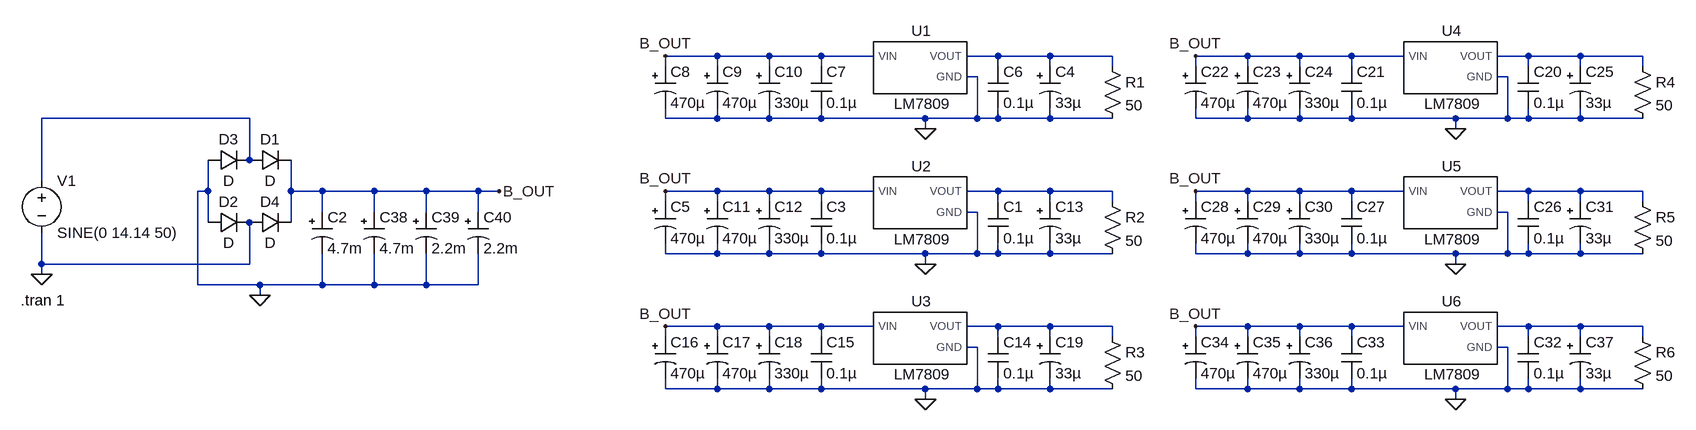
[diagram p0: schematic psu_230.asc]
psu_230.asc, the LTspice schematic file:
Version 4
SHEET 1 2616 680
WIRE 1136 112 1056 112
WIRE 1216 112 1136 112
WIRE 1296 112 1216 112
WIRE 1376 112 1296 112
WIRE 1568 112 1520 112
WIRE 1648 112 1568 112
WIRE 1744 112 1648 112
WIRE 1952 112 1872 112
WIRE 2032 112 1952 112
WIRE 2112 112 2032 112
WIRE 2192 112 2112 112
WIRE 2384 112 2336 112
WIRE 2464 112 2384 112
WIRE 2560 112 2464 112
WIRE 1056 128 1056 112
WIRE 1136 128 1136 112
WIRE 1216 128 1216 112
WIRE 1296 128 1296 112
WIRE 1568 128 1568 112
WIRE 1648 128 1648 112
WIRE 1744 128 1744 112
WIRE 1872 128 1872 112
WIRE 1952 128 1952 112
WIRE 2032 128 2032 112
WIRE 2112 128 2112 112
WIRE 2384 128 2384 112
WIRE 2464 128 2464 112
WIRE 2560 128 2560 112
WIRE 1536 144 1520 144
WIRE 2352 144 2336 144
WIRE 416 208 96 208
WIRE 1056 208 1056 192
WIRE 1136 208 1136 192
WIRE 1136 208 1056 208
WIRE 1216 208 1216 192
WIRE 1216 208 1136 208
WIRE 1296 208 1296 192
WIRE 1296 208 1216 208
WIRE 1456 208 1296 208
WIRE 1536 208 1536 144
WIRE 1536 208 1456 208
WIRE 1568 208 1568 192
WIRE 1568 208 1536 208
WIRE 1648 208 1648 192
WIRE 1648 208 1568 208
WIRE 1744 208 1648 208
WIRE 1872 208 1872 192
WIRE 1952 208 1952 192
WIRE 1952 208 1872 208
WIRE 2032 208 2032 192
WIRE 2032 208 1952 208
WIRE 2112 208 2112 192
WIRE 2112 208 2032 208
WIRE 2272 208 2112 208
WIRE 2352 208 2352 144
WIRE 2352 208 2272 208
WIRE 2384 208 2384 192
WIRE 2384 208 2352 208
WIRE 2464 208 2464 192
WIRE 2464 208 2384 208
WIRE 2560 208 2464 208
WIRE 1456 224 1456 208
WIRE 2272 224 2272 208
WIRE 416 272 416 208
WIRE 96 304 96 208
WIRE 352 320 352 272
WIRE 352 320 336 320
WIRE 480 320 480 272
WIRE 528 320 480 320
WIRE 608 320 528 320
WIRE 688 320 608 320
WIRE 768 320 688 320
WIRE 800 320 768 320
WIRE 1136 320 1056 320
WIRE 1216 320 1136 320
WIRE 1296 320 1216 320
WIRE 1376 320 1296 320
WIRE 1568 320 1520 320
WIRE 1648 320 1568 320
WIRE 1744 320 1648 320
WIRE 1952 320 1872 320
WIRE 2032 320 1952 320
WIRE 2112 320 2032 320
WIRE 2192 320 2112 320
WIRE 2384 320 2336 320
WIRE 2464 320 2384 320
WIRE 2560 320 2464 320
WIRE 1056 336 1056 320
WIRE 1136 336 1136 320
WIRE 1216 336 1216 320
WIRE 1296 336 1296 320
WIRE 1568 336 1568 320
WIRE 1648 336 1648 320
WIRE 1744 336 1744 320
WIRE 1872 336 1872 320
WIRE 1952 336 1952 320
WIRE 2032 336 2032 320
WIRE 2112 336 2112 320
WIRE 2384 336 2384 320
WIRE 2464 336 2464 320
WIRE 2560 336 2560 320
WIRE 528 352 528 320
WIRE 608 352 608 320
WIRE 688 352 688 320
WIRE 768 352 768 320
WIRE 1536 352 1520 352
WIRE 2352 352 2336 352
WIRE 352 368 352 320
WIRE 480 368 480 320
WIRE 1056 416 1056 400
WIRE 1136 416 1136 400
WIRE 1136 416 1056 416
WIRE 1216 416 1216 400
WIRE 1216 416 1136 416
WIRE 1296 416 1296 400
WIRE 1296 416 1216 416
WIRE 1456 416 1296 416
WIRE 1536 416 1536 352
WIRE 1536 416 1456 416
WIRE 1568 416 1568 400
WIRE 1568 416 1536 416
WIRE 1648 416 1648 400
WIRE 1648 416 1568 416
WIRE 1744 416 1648 416
WIRE 1872 416 1872 400
WIRE 1952 416 1952 400
WIRE 1952 416 1872 416
WIRE 2032 416 2032 400
WIRE 2032 416 1952 416
WIRE 2112 416 2112 400
WIRE 2112 416 2032 416
WIRE 2272 416 2112 416
WIRE 2352 416 2352 352
WIRE 2352 416 2272 416
WIRE 2384 416 2384 400
WIRE 2384 416 2352 416
WIRE 2464 416 2464 400
WIRE 2464 416 2384 416
WIRE 2560 416 2464 416
WIRE 96 432 96 384
WIRE 416 432 416 368
WIRE 416 432 96 432
WIRE 1456 432 1456 416
WIRE 2272 432 2272 416
WIRE 96 448 96 432
WIRE 336 464 336 320
WIRE 432 464 336 464
WIRE 528 464 528 416
WIRE 528 464 432 464
WIRE 608 464 608 416
WIRE 608 464 528 464
WIRE 688 464 688 416
WIRE 688 464 608 464
WIRE 768 464 768 416
WIRE 768 464 688 464
WIRE 432 480 432 464
WIRE 1136 528 1056 528
WIRE 1216 528 1136 528
WIRE 1296 528 1216 528
WIRE 1376 528 1296 528
WIRE 1568 528 1520 528
WIRE 1648 528 1568 528
WIRE 1744 528 1648 528
WIRE 1952 528 1872 528
WIRE 2032 528 1952 528
WIRE 2112 528 2032 528
WIRE 2192 528 2112 528
WIRE 2384 528 2336 528
WIRE 2464 528 2384 528
WIRE 2560 528 2464 528
WIRE 1056 544 1056 528
WIRE 1136 544 1136 528
WIRE 1216 544 1216 528
WIRE 1296 544 1296 528
WIRE 1568 544 1568 528
WIRE 1648 544 1648 528
WIRE 1744 544 1744 528
WIRE 1872 544 1872 528
WIRE 1952 544 1952 528
WIRE 2032 544 2032 528
WIRE 2112 544 2112 528
WIRE 2384 544 2384 528
WIRE 2464 544 2464 528
WIRE 2560 544 2560 528
WIRE 1536 560 1520 560
WIRE 2352 560 2336 560
WIRE 1056 624 1056 608
WIRE 1136 624 1136 608
WIRE 1136 624 1056 624
WIRE 1216 624 1216 608
WIRE 1216 624 1136 624
WIRE 1296 624 1296 608
WIRE 1296 624 1216 624
WIRE 1456 624 1296 624
WIRE 1536 624 1536 560
WIRE 1536 624 1456 624
WIRE 1568 624 1568 608
WIRE 1568 624 1536 624
WIRE 1648 624 1648 608
WIRE 1648 624 1568 624
WIRE 1744 624 1648 624
WIRE 1872 624 1872 608
WIRE 1952 624 1952 608
WIRE 1952 624 1872 624
WIRE 2032 624 2032 608
WIRE 2032 624 1952 624
WIRE 2112 624 2112 608
WIRE 2112 624 2032 624
WIRE 2272 624 2112 624
WIRE 2352 624 2352 560
WIRE 2352 624 2272 624
WIRE 2384 624 2384 608
WIRE 2384 624 2352 624
WIRE 2464 624 2464 608
WIRE 2464 624 2384 624
WIRE 2560 624 2464 624
WIRE 1456 640 1456 624
WIRE 2272 640 2272 624
FLAG 96 448 0
FLAG 1456 224 0
FLAG 432 480 0
FLAG 800 320 B_OUT
FLAG 1056 112 B_OUT
FLAG 1456 432 0
FLAG 1056 320 B_OUT
FLAG 1456 640 0
FLAG 1056 528 B_OUT
FLAG 2272 224 0
FLAG 1872 112 B_OUT
FLAG 2272 432 0
FLAG 1872 320 B_OUT
FLAG 2272 640 0
FLAG 1872 528 B_OUT
SYMBOL voltage 96 288 R0
WINDOW 123 0 0 Left 0
WINDOW 39 0 0 Left 0
SYMATTR InstName V1
SYMATTR Value SINE(0 14.14 50)
SYMBOL diode 352 288 R270
WINDOW 0 32 32 VTop 2
WINDOW 3 0 32 VBottom 2
SYMATTR InstName D3
SYMBOL diode 416 288 R270
WINDOW 0 32 32 VTop 2
WINDOW 3 0 32 VBottom 2
SYMATTR InstName D1
SYMBOL diode 352 384 R270
WINDOW 0 32 32 VTop 2
WINDOW 3 0 32 VBottom 2
SYMATTR InstName D2
SYMBOL diode 416 384 R270
WINDOW 0 32 32 VTop 2
WINDOW 3 0 32 VBottom 2
SYMATTR InstName D4
SYMBOL LM7809 1440 128 R0
SYMATTR InstName U1
SYMBOL cap 1552 128 R0
SYMATTR InstName C6
SYMATTR Value 0.1µ
SYMBOL cap 1280 128 R0
SYMATTR InstName C7
SYMATTR Value 0.1µ
SYMBOL res 1728 112 R0
SYMATTR InstName R1
SYMATTR Value 50
SYMBOL polcap 1040 128 R0
SYMATTR InstName C8
SYMATTR Value 470µ
SYMBOL polcap 1120 128 R0
SYMATTR InstName C9
SYMATTR Value 470µ
SYMBOL polcap 1200 128 R0
SYMATTR InstName C10
SYMATTR Value 330µ
SYMBOL polcap 1632 128 R0
SYMATTR InstName C4
SYMATTR Value 33µ
SYMBOL LM7809 1440 336 R0
SYMATTR InstName U2
SYMBOL cap 1552 336 R0
SYMATTR InstName C1
SYMATTR Value 0.1µ
SYMBOL cap 1280 336 R0
SYMATTR InstName C3
SYMATTR Value 0.1µ
SYMBOL res 1728 320 R0
SYMATTR InstName R2
SYMATTR Value 50
SYMBOL polcap 1040 336 R0
SYMATTR InstName C5
SYMATTR Value 470µ
SYMBOL polcap 1120 336 R0
SYMATTR InstName C11
SYMATTR Value 470µ
SYMBOL polcap 1200 336 R0
SYMATTR InstName C12
SYMATTR Value 330µ
SYMBOL polcap 1632 336 R0
SYMATTR InstName C13
SYMATTR Value 33µ
SYMBOL LM7809 1440 544 R0
SYMATTR InstName U3
SYMBOL cap 1552 544 R0
SYMATTR InstName C14
SYMATTR Value 0.1µ
SYMBOL cap 1280 544 R0
SYMATTR InstName C15
SYMATTR Value 0.1µ
SYMBOL res 1728 528 R0
SYMATTR InstName R3
SYMATTR Value 50
SYMBOL polcap 1040 544 R0
SYMATTR InstName C16
SYMATTR Value 470µ
SYMBOL polcap 1120 544 R0
SYMATTR InstName C17
SYMATTR Value 470µ
SYMBOL polcap 1200 544 R0
SYMATTR InstName C18
SYMATTR Value 330µ
SYMBOL polcap 1632 544 R0
SYMATTR InstName C19
SYMATTR Value 33µ
SYMBOL LM7809 2256 128 R0
SYMATTR InstName U4
SYMBOL cap 2368 128 R0
SYMATTR InstName C20
SYMATTR Value 0.1µ
SYMBOL cap 2096 128 R0
SYMATTR InstName C21
SYMATTR Value 0.1µ
SYMBOL res 2544 112 R0
SYMATTR InstName R4
SYMATTR Value 50
SYMBOL polcap 1856 128 R0
SYMATTR InstName C22
SYMATTR Value 470µ
SYMBOL polcap 1936 128 R0
SYMATTR InstName C23
SYMATTR Value 470µ
SYMBOL polcap 2016 128 R0
SYMATTR InstName C24
SYMATTR Value 330µ
SYMBOL polcap 2448 128 R0
SYMATTR InstName C25
SYMATTR Value 33µ
SYMBOL LM7809 2256 336 R0
SYMATTR InstName U5
SYMBOL cap 2368 336 R0
SYMATTR InstName C26
SYMATTR Value 0.1µ
SYMBOL cap 2096 336 R0
SYMATTR InstName C27
SYMATTR Value 0.1µ
SYMBOL res 2544 320 R0
SYMATTR InstName R5
SYMATTR Value 50
SYMBOL polcap 1856 336 R0
SYMATTR InstName C28
SYMATTR Value 470µ
SYMBOL polcap 1936 336 R0
SYMATTR InstName C29
SYMATTR Value 470µ
SYMBOL polcap 2016 336 R0
SYMATTR InstName C30
SYMATTR Value 330µ
SYMBOL polcap 2448 336 R0
SYMATTR InstName C31
SYMATTR Value 33µ
SYMBOL LM7809 2256 544 R0
SYMATTR InstName U6
SYMBOL cap 2368 544 R0
SYMATTR InstName C32
SYMATTR Value 0.1µ
SYMBOL cap 2096 544 R0
SYMATTR InstName C33
SYMATTR Value 0.1µ
SYMBOL res 2544 528 R0
SYMATTR InstName R6
SYMATTR Value 50
SYMBOL polcap 1856 544 R0
SYMATTR InstName C34
SYMATTR Value 470µ
SYMBOL polcap 1936 544 R0
SYMATTR InstName C35
SYMATTR Value 470µ
SYMBOL polcap 2016 544 R0
SYMATTR InstName C36
SYMATTR Value 330µ
SYMBOL polcap 2448 544 R0
SYMATTR InstName C37
SYMATTR Value 33µ
SYMBOL polcap 512 352 R0
SYMATTR InstName C2
SYMATTR Value 4.7m
SYMATTR SpiceLine Rser=50m
SYMBOL polcap 592 352 R0
SYMATTR InstName C38
SYMATTR Value 4.7m
SYMATTR SpiceLine Rser=50m
SYMBOL polcap 672 352 R0
SYMATTR InstName C39
SYMATTR Value 2.2m
SYMATTR SpiceLine Rser=33m
SYMBOL polcap 752 352 R0
SYMATTR InstName C40
SYMATTR Value 2.2m
SYMATTR SpiceLine Rser=33m
TEXT 64 488 Left 2 !.tran 1

The netlist it stands for:
* psu_230.asc
V1 N003 0 SINE(0 14.14 50)
D3 0 N003 D
D1 N003 B_OUT D
D2 0 0 D
D4 0 B_OUT D
XU1 B_OUT 0 N001 LM7809  ; pins VIN GND VOUT
C6 N001 0 0.1µ
C7 B_OUT 0 0.1µ
R1 N001 0 50
C8 B_OUT 0 470µ
C9 B_OUT 0 470µ
C10 B_OUT 0 330µ
C4 N001 0 33µ
XU2 B_OUT 0 N004 LM7809  ; pins VIN GND VOUT
C1 N004 0 0.1µ
C3 B_OUT 0 0.1µ
R2 N004 0 50
C5 B_OUT 0 470µ
C11 B_OUT 0 470µ
C12 B_OUT 0 330µ
C13 N004 0 33µ
XU3 B_OUT 0 N006 LM7809  ; pins VIN GND VOUT
C14 N006 0 0.1µ
C15 B_OUT 0 0.1µ
R3 N006 0 50
C16 B_OUT 0 470µ
C17 B_OUT 0 470µ
C18 B_OUT 0 330µ
C19 N006 0 33µ
XU4 B_OUT 0 N002 LM7809  ; pins VIN GND VOUT
C20 N002 0 0.1µ
C21 B_OUT 0 0.1µ
R4 N002 0 50
C22 B_OUT 0 470µ
C23 B_OUT 0 470µ
C24 B_OUT 0 330µ
C25 N002 0 33µ
XU5 B_OUT 0 N005 LM7809  ; pins VIN GND VOUT
C26 N005 0 0.1µ
C27 B_OUT 0 0.1µ
R5 N005 0 50
C28 B_OUT 0 470µ
C29 B_OUT 0 470µ
C30 B_OUT 0 330µ
C31 N005 0 33µ
XU6 B_OUT 0 N007 LM7809  ; pins VIN GND VOUT
C32 N007 0 0.1µ
C33 B_OUT 0 0.1µ
R6 N007 0 50
C34 B_OUT 0 470µ
C35 B_OUT 0 470µ
C36 B_OUT 0 330µ
C37 N007 0 33µ
C2 B_OUT 0 4.7m Rser=50m
C38 B_OUT 0 4.7m Rser=50m
C39 B_OUT 0 2.2m Rser=33m
C40 B_OUT 0 2.2m Rser=33m
.model D D
.lib standard.dio
.tran 1
.lib C:\Users\DanielKopiecki\Desktop\personal\sk\spice\lm7805.cir
.backanno
.end